# EAGLE design minidoxs (EAGLE 9.5.0)
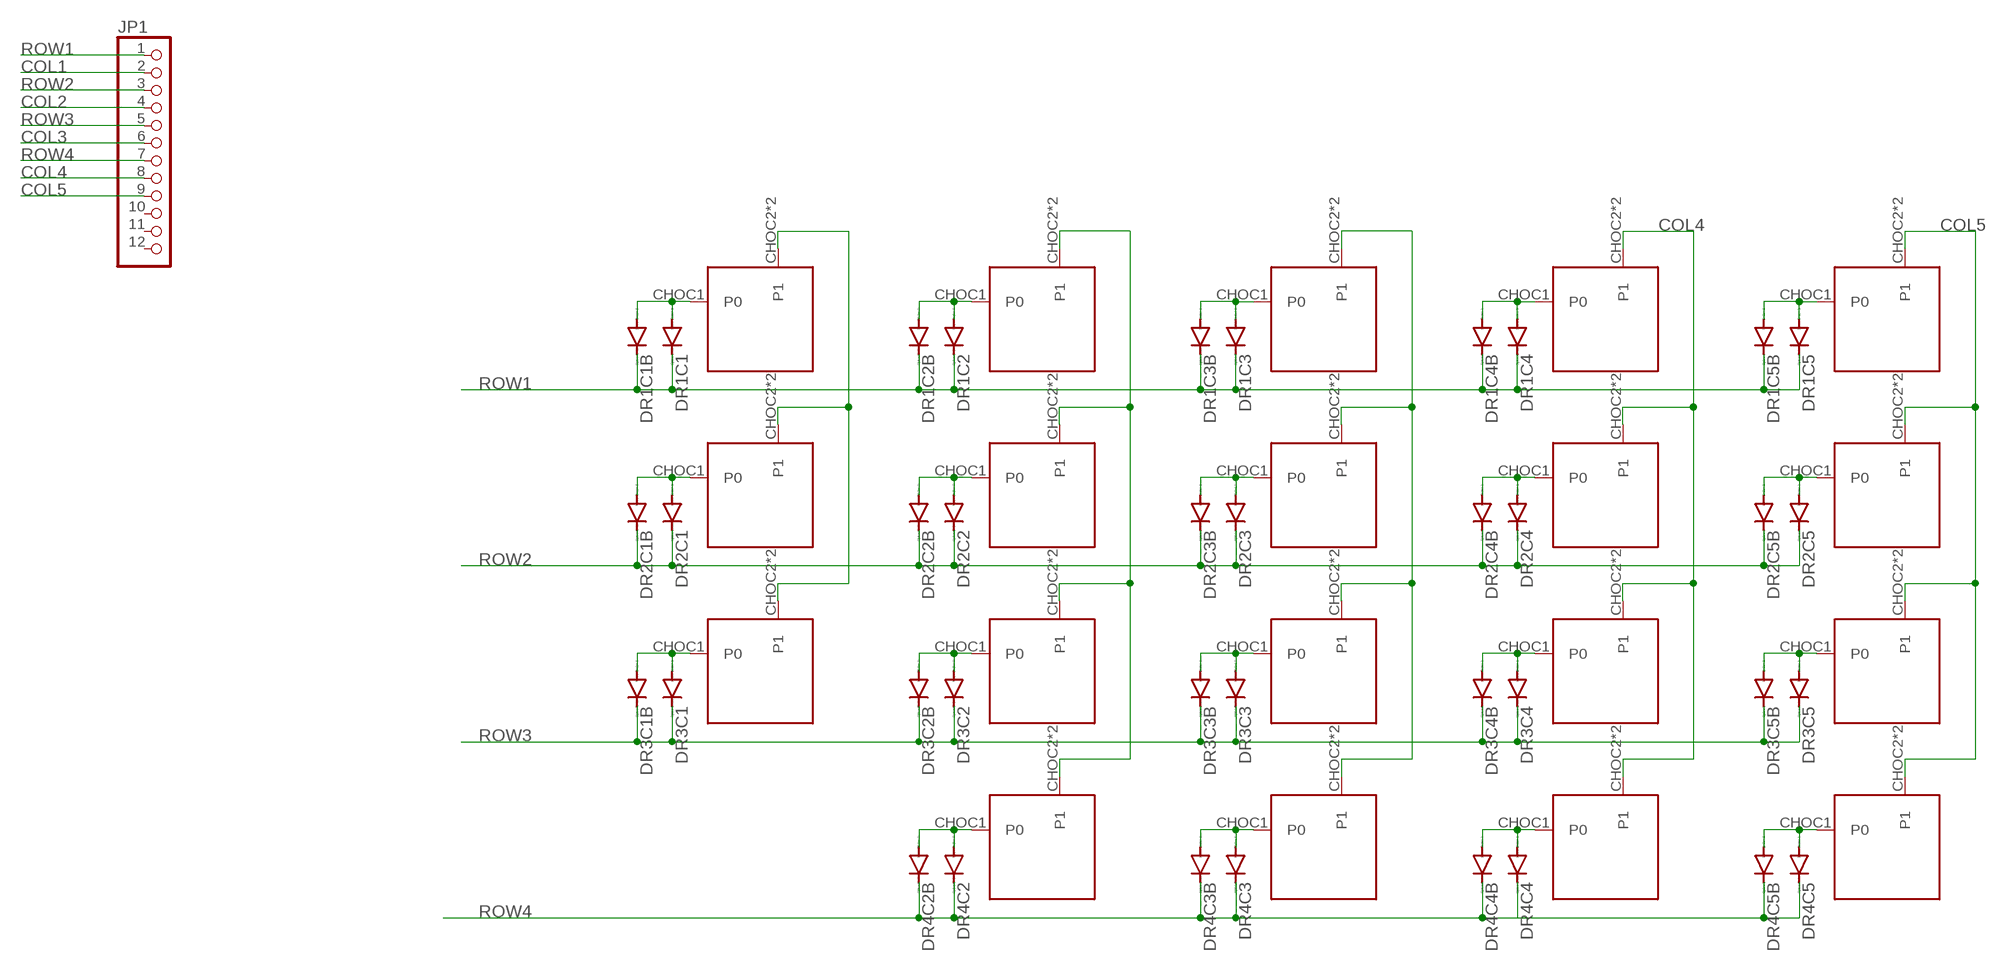
[diagram p0: schematic, sheet 1]

## Parts
DR1C1  MBR0520LT  [SOD123]
DR1C1B  MBR0520LT  [SOD123]
DR1C2  MBR0520LT  [SOD123]
DR1C2B  MBR0520LT  [SOD123]
DR1C3  MBR0520LT  [SOD123]
DR1C3B  MBR0520LT  [SOD123]
DR1C4  MBR0520LT  [SOD123]
DR1C4B  MBR0520LT  [SOD123]
DR1C5  MBR0520LT  [SOD123]
DR1C5B  MBR0520LT  [SOD123]
DR2C1  MBR0520LT  [SOD123]
DR2C1B  MBR0520LT  [SOD123]
DR2C2  MBR0520LT  [SOD123]
DR2C2B  MBR0520LT  [SOD123]
DR2C3  MBR0520LT  [SOD123]
DR2C3B  MBR0520LT  [SOD123]
DR2C4  MBR0520LT  [SOD123]
DR2C4B  MBR0520LT  [SOD123]
DR2C5  MBR0520LT  [SOD123]
DR2C5B  MBR0520LT  [SOD123]
DR3C1  MBR0520LT  [SOD123]
DR3C1B  MBR0520LT  [SOD123]
DR3C2  MBR0520LT  [SOD123]
DR3C2B  MBR0520LT  [SOD123]
DR3C3  MBR0520LT  [SOD123]
DR3C3B  MBR0520LT  [SOD123]
DR3C4  MBR0520LT  [SOD123]
DR3C4B  MBR0520LT  [SOD123]
DR3C5  MBR0520LT  [SOD123]
DR3C5B  MBR0520LT  [SOD123]
DR4C2  MBR0520LT  [SOD123]
DR4C2B  MBR0520LT  [SOD123]
DR4C3  MBR0520LT  [SOD123]
DR4C3B  MBR0520LT  [SOD123]
DR4C4  MBR0520LT  [SOD123]
DR4C4B  MBR0520LT  [SOD123]
DR4C5  MBR0520LT  [SOD123]
DR4C5B  MBR0520LT  [SOD123]
JP1  PINHD-1X12  [1X12]
U$R1C1  KEYSWITCH-PLAIN-CHOC-1U  [CHOC-1U]
U$R1C2  KEYSWITCH-PLAIN-CHOC-1U  [CHOC-1U]
U$R1C3  KEYSWITCH-PLAIN-CHOC-1U  [CHOC-1U]
U$R1C4  KEYSWITCH-PLAIN-CHOC-1U  [CHOC-1U]
U$R1C5  KEYSWITCH-PLAIN-CHOC-1U  [CHOC-1U]
U$R2C1  KEYSWITCH-PLAIN-CHOC-1U  [CHOC-1U]
U$R2C2  KEYSWITCH-PLAIN-CHOC-1U  [CHOC-1U]
U$R2C3  KEYSWITCH-PLAIN-CHOC-1U  [CHOC-1U]
U$R2C4  KEYSWITCH-PLAIN-CHOC-1U  [CHOC-1U]
U$R2C5  KEYSWITCH-PLAIN-CHOC-1U  [CHOC-1U]
U$R3C1  KEYSWITCH-PLAIN-CHOC-1U  [CHOC-1U]
U$R3C2  KEYSWITCH-PLAIN-CHOC-1U  [CHOC-1U]
U$R3C3  KEYSWITCH-PLAIN-CHOC-1U  [CHOC-1U]
U$R3C4  KEYSWITCH-PLAIN-CHOC-1U  [CHOC-1U]
U$R3C5  KEYSWITCH-PLAIN-CHOC-1U  [CHOC-1U]
U$R4C2  KEYSWITCH-PLAIN-CHOC-1U  [CHOC-1U]
U$R4C3  KEYSWITCH-PLAIN-CHOC-1U  [CHOC-1U]
U$R4C4  KEYSWITCH-PLAIN-CHOC-1U  [CHOC-1U]
U$R4C5  KEYSWITCH-PLAIN-CHOC-1U  [CHOC-1U]

## Nets
COL1: JP1.2 U$R1C1.CHOC2(P1) U$R1C1.CHOC3(P1) U$R2C1.CHOC2(P1) U$R2C1.CHOC3(P1) U$R3C1.CHOC2(P1) U$R3C1.CHOC3(P1)
COL2: JP1.4 U$R1C2.CHOC2(P1) U$R1C2.CHOC3(P1) U$R2C2.CHOC2(P1) U$R2C2.CHOC3(P1) U$R3C2.CHOC2(P1) U$R3C2.CHOC3(P1) U$R4C2.CHOC2(P1) U$R4C2.CHOC3(P1)
COL3: JP1.6 U$R1C3.CHOC2(P1) U$R1C3.CHOC3(P1) U$R2C3.CHOC2(P1) U$R2C3.CHOC3(P1) U$R3C3.CHOC2(P1) U$R3C3.CHOC3(P1) U$R4C3.CHOC2(P1) U$R4C3.CHOC3(P1)
COL4: JP1.8 U$R1C4.CHOC2(P1) U$R1C4.CHOC3(P1) U$R2C4.CHOC2(P1) U$R2C4.CHOC3(P1) U$R3C4.CHOC2(P1) U$R3C4.CHOC3(P1) U$R4C4.CHOC2(P1) U$R4C4.CHOC3(P1)
COL5: JP1.9 U$R1C5.CHOC2(P1) U$R1C5.CHOC3(P1) U$R2C5.CHOC2(P1) U$R2C5.CHOC3(P1) U$R3C5.CHOC2(P1) U$R3C5.CHOC3(P1) U$R4C5.CHOC2(P1) U$R4C5.CHOC3(P1)
N$1: DR1C1.A DR1C1B.A U$R1C1.CHOC1(P0)
N$2: DR2C1.A DR2C1B.A U$R2C1.CHOC1(P0)
N$3: DR1C5.A DR1C5B.A U$R1C5.CHOC1(P0)
N$4: DR1C4.A DR1C4B.A U$R1C4.CHOC1(P0)
N$5: DR1C3.A DR1C3B.A U$R1C3.CHOC1(P0)
N$6: DR2C2.A DR2C2B.A U$R2C2.CHOC1(P0)
N$7: DR2C3.A DR2C3B.A U$R2C3.CHOC1(P0)
N$8: DR2C4.A DR2C4B.A U$R2C4.CHOC1(P0)
N$9: DR1C2.A DR1C2B.A U$R1C2.CHOC1(P0)
N$10: DR2C5.A DR2C5B.A U$R2C5.CHOC1(P0)
N$11: DR3C4.A DR3C4B.A U$R3C4.CHOC1(P0)
N$12: DR3C3.A DR3C3B.A U$R3C3.CHOC1(P0)
N$13: DR3C2.A DR3C2B.A U$R3C2.CHOC1(P0)
N$14: DR3C1.A DR3C1B.A U$R3C1.CHOC1(P0)
N$15: DR3C5.A DR3C5B.A U$R3C5.CHOC1(P0)
N$16: DR4C4.A DR4C4B.A U$R4C4.CHOC1(P0)
N$17: DR4C3.A DR4C3B.A U$R4C3.CHOC1(P0)
N$18: DR4C2.A DR4C2B.A U$R4C2.CHOC1(P0)
N$19: DR4C5.A DR4C5B.A U$R4C5.CHOC1(P0)
ROW1: DR1C1.C DR1C1B.C DR1C2.C DR1C2B.C DR1C3.C DR1C3B.C DR1C4.C DR1C4B.C DR1C5.C DR1C5B.C JP1.1
ROW2: DR2C1.C DR2C1B.C DR2C2.C DR2C2B.C DR2C3.C DR2C3B.C DR2C4.C DR2C4B.C DR2C5.C DR2C5B.C JP1.3
ROW3: DR3C1.C DR3C1B.C DR3C2.C DR3C2B.C DR3C3.C DR3C3B.C DR3C4.C DR3C4B.C DR3C5.C DR3C5B.C JP1.5
ROW4: DR4C2.C DR4C2B.C DR4C3.C DR4C3B.C DR4C4.C DR4C4B.C DR4C5.C DR4C5B.C JP1.7
Unconnected: JP1.10 JP1.11 JP1.12

## Library data of the parts
DR1C1 DR1C1B DR1C2 DR1C2B DR1C3 DR1C3B DR1C4 DR1C4B DR1C5 DR1C5B DR2C1 DR2C1B DR2C2 DR2C2B DR2C3 DR2C3B DR2C4 DR2C4B DR2C5 DR2C5B DR3C1 DR3C1B DR3C2 DR3C2B DR3C3 DR3C3B DR3C4 DR3C4B DR3C5 DR3C5B DR4C2 DR4C2B DR4C3 DR4C3B DR4C4 DR4C4B DR4C5 DR4C5B = diode:MBR0520LT: SCHOTTKY BARRIER RECTIFIER Source: http://onsemi.com .. MBR0520LT1-D.pdf
JP1 = pinhead:PINHD-1X12: PIN HEADER
U$R1C1-U$R1C5 U$R2C1-U$R2C5 U$R3C1-U$R3C5 U$R4C2-U$R4C5 = Keyboard:KEYSWITCH-PLAIN

## Net classes
0 default: width 0.406 mm, clearance 0.406 mm

## Board
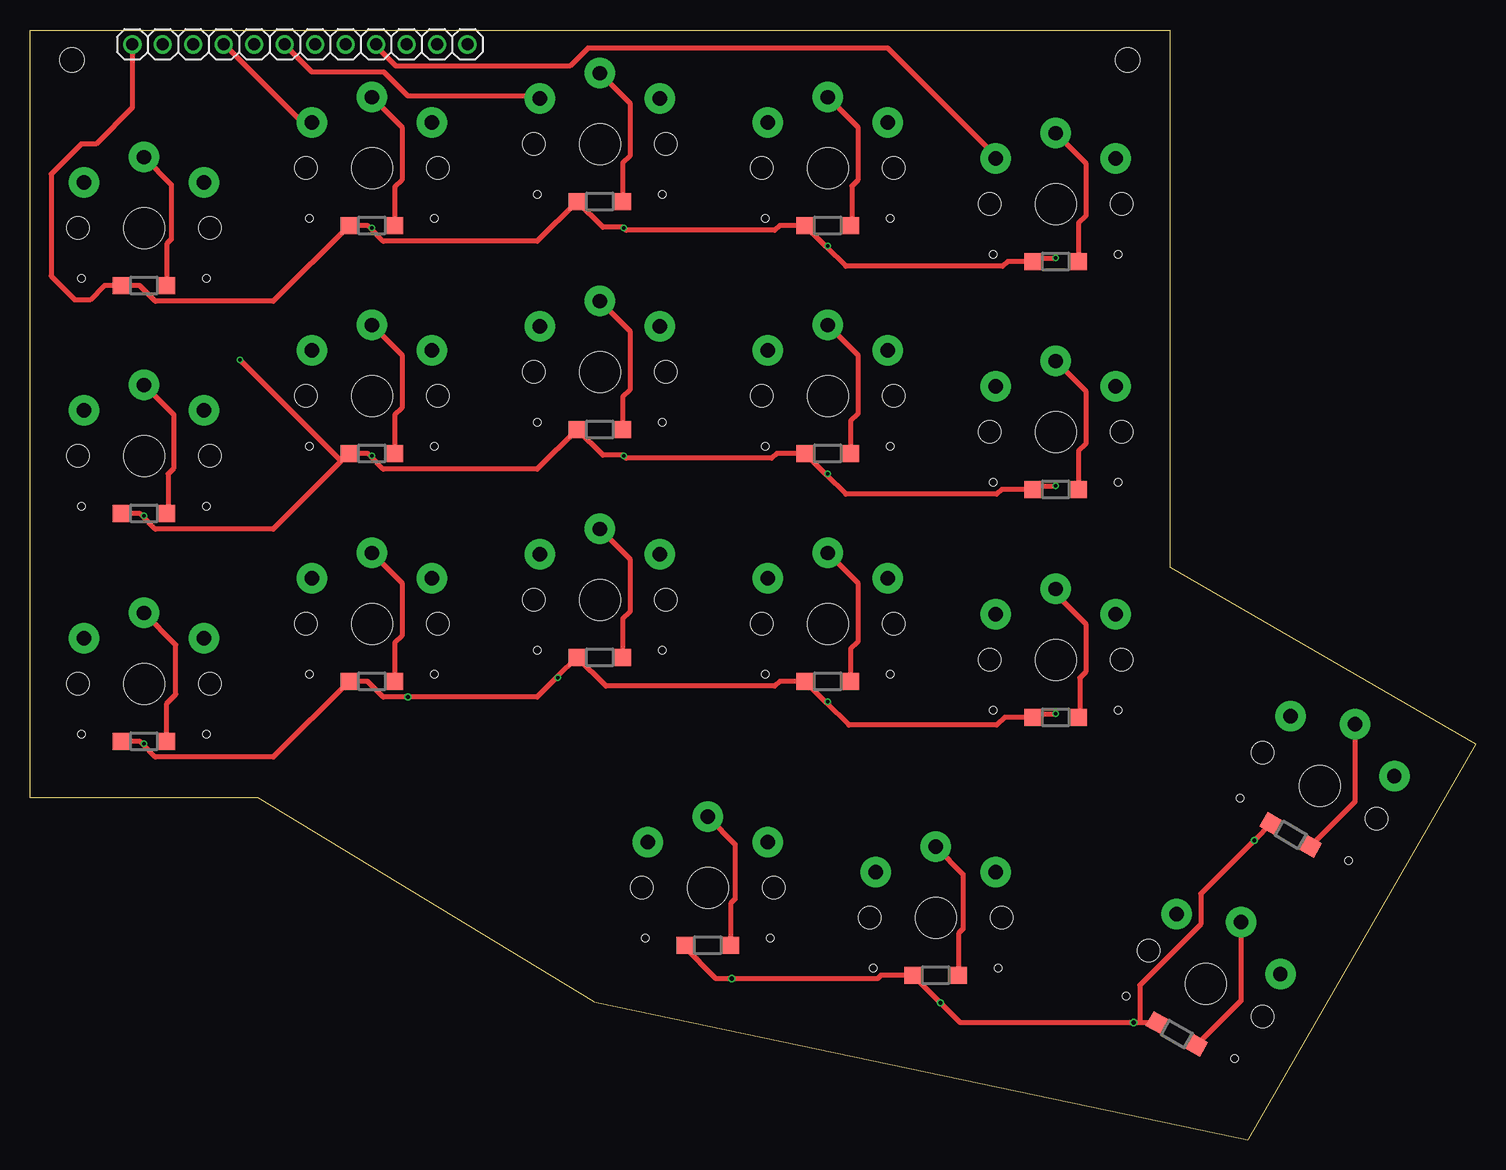
[diagram p1: board, top side]
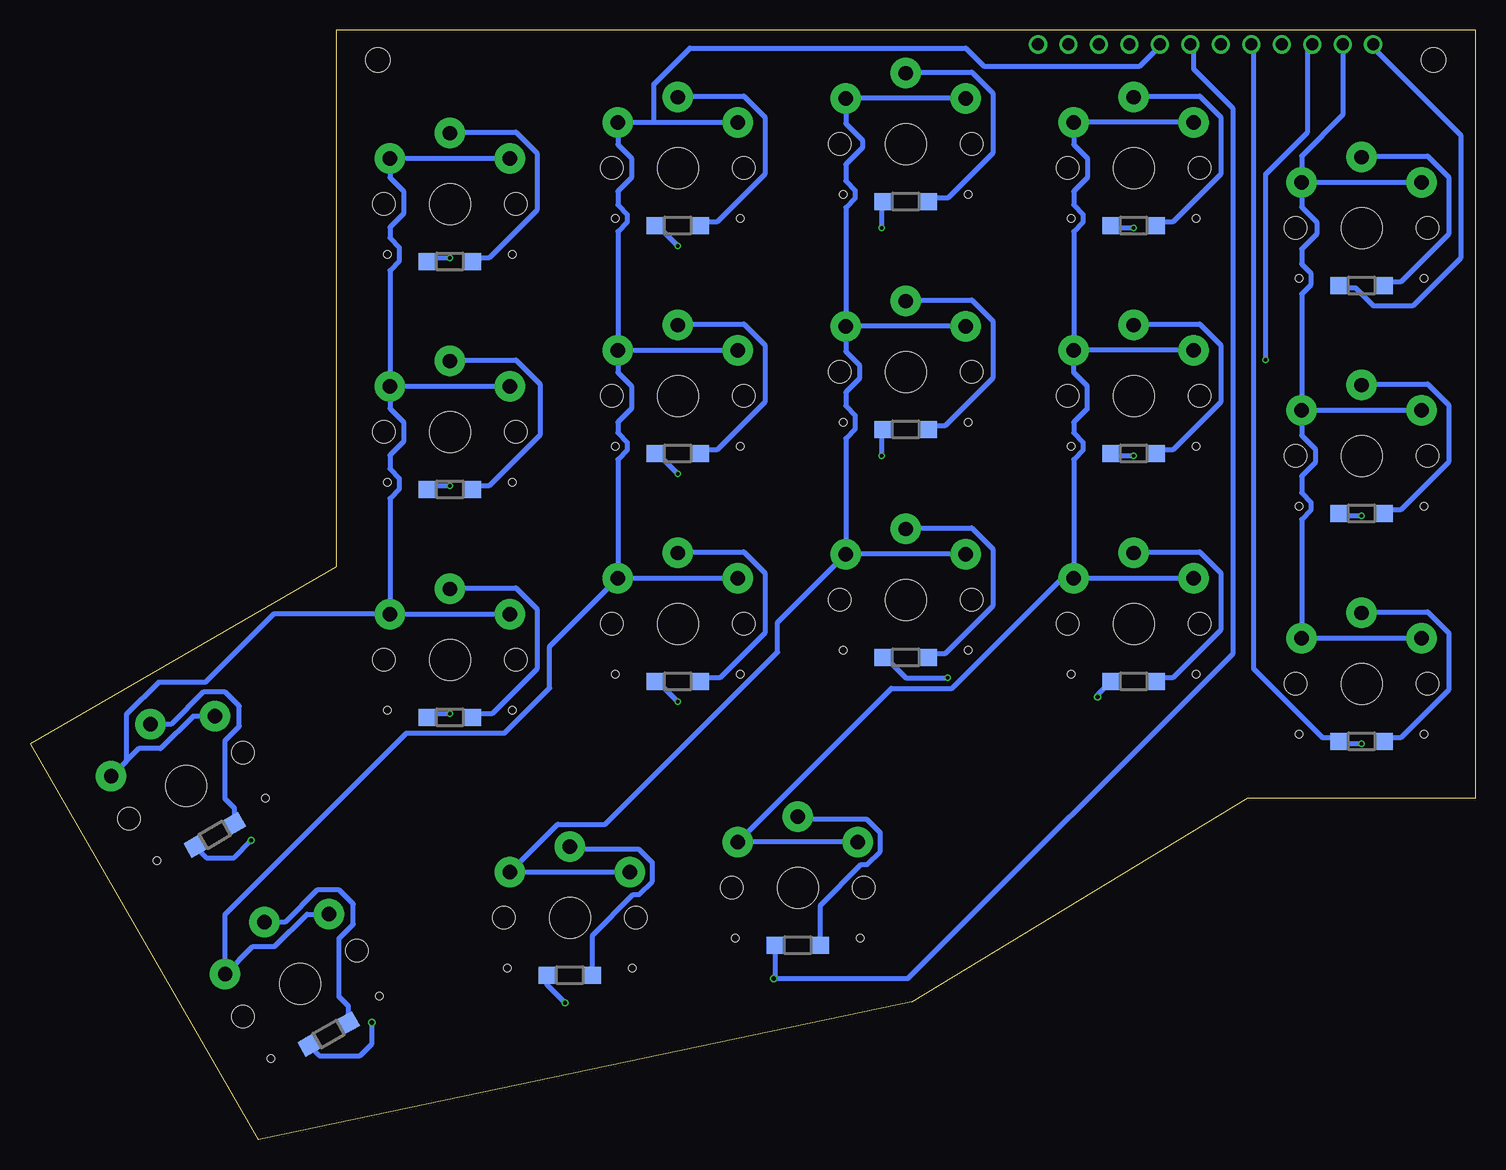
[diagram p2: board, bottom side, seen from below]

Size 120.5 x 92.5 mm. Coordinates in mm from the lower left corner, seen from the top.
Outline: 0,92.5 95,92.5 95,47.75 120.5,33 101.5,0 47,11.5 19,28.5 0,28.5 0,92.5
Copper layers (1*16): Top 0.035559375mm / dielectric 1.6mm / Bottom 0.035559375mm
Design rules "oshpark-2layer": minimum track width 6mil, minimum drill 10mil, track to track 6mil, track to pad 6mil, pad to pad 6mil, via to via 6mil, smd to smd 6mil, copper to edge 15mil, drill to drill 6mil, minimum pad ring 5mil, minimum via ring 5mil, stop-mask expansion 2.5mil, vias tented up to drill 0mil, thermal gap 10mil
Holes 2 mm at 3.5,90 91.5,90

### Footprints (pad centres in the part's own frame; a part is rotated, then mirrored left to right if it is on the bottom)
SOD123 = smd 1.4 x 1.4: A 1.9,0; C -1.9,0
1X12 = drill 1.016: 1 -13.97,0; 2 -11.43,0; 3 -8.89,0; 4 -6.35,0; 5 -3.81,0; 6 -1.27,0; 7 1.27,0; 8 3.81,0; 9 6.35,0; 10 8.89,0; 11 11.43,0; 12 13.97,0
CHOC-1U = drill 1.2 pad 2.54: CHOC1 0,5.9; CHOC2 5,3.8; CHOC3 -5,3.8 | hole 3.4: 0,0 | hole 0.6: -5.22,-4.2; 5.22,-4.2 | hole 1.85: -5.5,0; 5.5,0

### Placement (x,y rotation side)
DR1C1  9.5,71.2 0 top
DR1C1B  9.5,71.2 0 bottom
DR1C2  28.5,76.2 0 top
DR1C2B  28.5,76.2 0 bottom
DR1C3  47.5,78.2 0 top
DR1C3B  47.5,78.2 0 bottom
DR1C4  66.5,76.2 0 top
DR1C4B  66.5,76.2 0 bottom
DR1C5  85.5,73.2 0 top
DR1C5B  85.5,73.2 0 bottom
DR2C1  9.5,52.2 0 top
DR2C1B  9.5,52.2 0 bottom
DR2C2  28.5,57.2 0 top
DR2C2B  28.5,57.2 0 bottom
DR2C3  47.5,59.2 0 top
DR2C3B  47.5,59.2 0 bottom
DR2C4  66.5,57.2 0 top
DR2C4B  66.5,57.2 0 bottom
DR2C5  85.5,54.2 0 top
DR2C5B  85.5,54.2 0 bottom
DR3C1  9.5,33.2 0 top
DR3C1B  9.5,33.2 0 bottom
DR3C2  28.5,38.2 0 top
DR3C2B  28.5,38.2 0 bottom
DR3C3  47.5,40.2 0 top
DR3C3B  47.5,40.2 0 bottom
DR3C4  66.5,38.2 0 top
DR3C4B  66.5,38.2 0 bottom
DR3C5  85.5,35.2 0 top
DR3C5B  85.5,35.2 0 bottom
DR4C2  56.5,16.2 0 top
DR4C2B  56.5,16.2 0 bottom
DR4C3  75.5,13.7 0 top
DR4C3B  75.5,13.7 0 bottom
DR4C4  95.6,8.8 330 top
DR4C4B  95.6,8.8 30 bottom
DR4C5  105.1,25.4 330 top
DR4C5B  105.1,25.4 30 bottom
JP1  22.5,91.3 0 top
U$R1C1  9.5,76 0 top
U$R1C2  28.5,81 0 top
U$R1C3  47.5,83 0 top
U$R1C4  66.5,81 0 top
U$R1C5  85.5,78 0 top
U$R2C1  9.5,57 0 top
U$R2C2  28.5,62 0 top
U$R2C3  47.5,64 0 top
U$R2C4  66.5,62 0 top
U$R2C5  85.5,59 0 top
U$R3C1  9.5,38 0 top
U$R3C2  28.5,43 0 top
U$R3C3  47.5,45 0 top
U$R3C4  66.5,43 0 top
U$R3C5  85.5,40 0 top
U$R4C2  56.5,21 0 top
U$R4C3  75.5,18.5 0 top
U$R4C4  98,13 330 top
U$R4C5  107.5,29.5 330 top

### Tracks (layer width: path | path; a pad name or v marks a point on that pad's centre or on a via)
COL1
  Bottom 0.406: U$R1C1.CHOC2 14.5,82 11.07,85.43 JP1.2 | U$R1C1.CHOC2 U$R1C1.CHOC3 | U$R1C1.CHOC2 14.5,77.75 13.25,76.5 13.25,75.5 14.5,74.25 14.5,73 13.75,72.25 13.75,71.25 14.5,70.5 U$R2C1.CHOC2 | U$R2C1.CHOC2 14.5,58.7 13.37,57.57 13.37,56.43 14.5,55.3 14.5,53.9 13.71,53.11 13.71,52.49 14.5,51.7 U$R3C1.CHOC2 U$R3C1.CHOC3 | U$R2C1.CHOC2 U$R2C1.CHOC3
COL2
  Top 0.406: JP1.4 16.5,91 22.5,85 23.5,85 U$R1C2.CHOC3
  Bottom 0.406: U$R1C2.CHOC2 33.5,84.5 | 33.5,84.5 33.5,82.95 32.37,81.82 32.37,80.18 33.5,79.05 33.5,77.9 32.71,77.11 32.71,76.49 33.5,75.7 U$R2C2.CHOC2 33.5,65.5 | 33.5,65.5 33.5,63.95 32.37,62.82 32.37,60.93 33.5,59.8 33.5,58.9 32.71,58.11 32.71,57.49 33.5,56.7 U$R3C2.CHOC2 | U$R2C2.CHOC3 33.2,65.8 33.5,65.5 | U$R3C2.CHOC2 U$R3C2.CHOC3 | U$R1C2.CHOC3 33.2,84.8 33.5,84.5 | U$R4C2.CHOC3 U$R4C2.CHOC2 48.69,37.61 43.63,37.61 34.44,46.8 U$R3C2.CHOC2
COL3
  Top 0.406: JP1.6 21.5,91 23.5,89 29.5,89 31.5,87 42.5,87 U$R1C3.CHOC3
  Bottom 0.406: 52.5,67.5 U$R2C3.CHOC2 52.5,77.7 51.71,78.49 51.71,79.11 52.5,79.9 52.5,81.3 51.12,82.68 51.12,83.32 52.5,84.7 U$R1C3.CHOC2 U$R1C3.CHOC3 | 52.5,67.5 52.5,65.7 51.37,64.57 51.37,63.43 52.5,62.3 52.5,61.15 51.71,60.36 51.71,59.24 52.5,58.45 U$R3C3.CHOC2 | U$R2C3.CHOC3 52.2,67.8 52.5,67.5 | U$R3C3.CHOC3 52.3,48.8 52.5,49 U$R3C3.CHOC2 | U$R3C3.CHOC2 58.19,43.11 58.19,40.64 72.55,26.28 76.52,26.28 U$R4C3.CHOC2 U$R4C3.CHOC3
COL4
  Bottom 0.406: U$R2C4.CHOC2 71.5,63.95 70.37,62.82 70.37,60.93 71.5,59.8 71.5,58.9 70.71,58.11 70.71,57.49 71.5,56.7 U$R3C4.CHOC2 | U$R3C4.CHOC2 62.3,46.8 62,46.5 61.8,46.5 U$R3C4.CHOC3 | U$R2C4.CHOC2 U$R2C4.CHOC3 | 68.5,84.8 U$R1C4.CHOC2 71.5,82.95 70.37,81.82 70.37,80.18 71.5,79.05 71.5,77.9 70.71,77.11 70.71,76.49 71.5,75.7 U$R2C4.CHOC2 | 68.5,84.8 U$R1C4.CHOC3 | 68.5,84.8 68.5,88 65.5,91 42.5,91 41,89.5 28,89.5 26.5,91 JP1.8 | U$R3C4.CHOC2 77.19,41.11 77.19,37.64 80.94,33.89 89.11,33.89 104.23,18.77 U$R4C4.CHOC2 101.93,16.09 100.11,16.09 97.42,18.79 U$R4C4.CHOC3
COL5
  Top 0.406: JP1.9 29,91 30.5,89.5 45,89.5 46.5,91 71.5,91 80.5,82 U$R1C5.CHOC3
  Bottom 0.406: U$R2C5.CHOC2 90.5,60.95 89.37,59.82 89.37,58.18 90.5,57.05 90.5,55.9 89.71,55.11 89.71,54.24 90.5,53.45 U$R3C5.CHOC2 | U$R1C5.CHOC3 U$R1C5.CHOC2 90.5,80.2 89.37,79.07 89.37,77.18 90.5,76.05 90.5,75.15 89.71,74.36 89.71,73.24 90.5,72.45 U$R2C5.CHOC2 | U$R2C5.CHOC2 U$R2C5.CHOC3 | U$R3C5.CHOC2 U$R3C5.CHOC3 | U$R4C5.CHOC3 106.92,35.29 109.61,32.59 111.43,32.59 U$R4C5.CHOC2 114,30.02 114,30 112.47,31.53 112.47,35.45 109.79,38.12 105.88,38.12 100.2,43.8 U$R3C5.CHOC2
N$1
  Top 0.406: DR1C1.A 11.4,74.67 11.78,75.05 11.78,79.62 U$R1C1.CHOC1
  Bottom 0.406: DR1C1B.A 7.5,71.5 6.25,71.5 2.25,75.5 2.25,80.25 4,82 9.5,82 U$R1C1.CHOC1
N$2
  Top 0.406: DR2C1.A 11.5,52.3 11.5,55.5 12,56 12,60.4 U$R2C1.CHOC1
  Bottom 0.406: DR2C1B.A 7.5,52.5 6.25,52.5 2.25,56.5 2.25,61.25 4,63 9.5,63 U$R2C1.CHOC1
N$3
  Top 0.406: DR1C5.A 87.4,76.4 88,77 88,81.4 U$R1C5.CHOC1
  Bottom 0.406: DR1C5B.A 83.5,73.5 82.25,73.5 78.25,77.5 78.25,82.25 80,84 85.5,84 U$R1C5.CHOC1
N$4
  Top 0.406: DR1C4.A 68.5,76.3 68.5,79.5 69,80 69,84.4 U$R1C4.CHOC1
  Bottom 0.406: DR1C4B.A 64.5,76.5 63.25,76.5 59.25,80.5 59.25,85.25 61,87 66.5,87 U$R1C4.CHOC1
N$5
  Top 0.406: DR1C3.A 49.4,81.4 50,82 50,86.4 U$R1C3.CHOC1
  Bottom 0.406: DR1C3B.A 45.5,78.5 44,78.5 40.25,82.25 40.25,87.25 42,89 47.5,89 U$R1C3.CHOC1
N$6
  Top 0.406: DR2C2.A 30.4,60.4 31,61 31,65.4 U$R2C2.CHOC1
  Bottom 0.406: DR2C2B.A 26.5,57.5 25.25,57.5 21.25,61.5 21.25,66.25 23,68 28.5,68 U$R2C2.CHOC1
N$7
  Top 0.406: DR2C3.A 49.4,61.9 50,62.5 50,67.4 U$R2C3.CHOC1
  Bottom 0.406: DR2C3B.A 45.5,59.5 44.25,59.5 40.25,63.5 40.25,68.25 42,70 47.5,70 U$R2C3.CHOC1
N$8
  Top 0.406: DR2C4.A 68.4,59.9 69,60.5 69,65.4 U$R2C4.CHOC1
  Bottom 0.406: DR2C4B.A 64.5,57.5 63.25,57.5 59.25,61.5 59.25,66.25 61,68 66.5,68 U$R2C4.CHOC1
N$9
  Top 0.406: DR1C2.A 30.4,79.4 31,80 31,84.4 U$R1C2.CHOC1
  Bottom 0.406: DR1C2B.A 26.5,76.5 25.25,76.5 21.25,80.5 21.25,85.25 23,87 28.5,87 U$R1C2.CHOC1
N$10
  Top 0.406: DR2C5.A 87.4,57.4 88,58 88,62.4 U$R2C5.CHOC1
  Bottom 0.406: DR2C5B.A 83.5,54.5 82.25,54.5 78,58.75 78,63 80,65 85.5,65 U$R2C5.CHOC1
N$11
  Top 0.406: DR3C4.A 68.4,40.9 69,41.5 69,46.4 U$R3C4.CHOC1
  Bottom 0.406: DR3C4B.A 64.5,38.5 63,38.5 59.25,42.25 59.25,47.25 61,49 66.5,49 U$R3C4.CHOC1
N$12
  Top 0.406: DR3C3.A 49.4,43.4 50,44 50,48.4 U$R3C3.CHOC1
  Bottom 0.406: DR3C3B.A 45.5,40.5 44.25,40.5 40.25,44.5 40.25,49.25 42,51 47.5,51 U$R3C3.CHOC1
N$13
  Top 0.406: DR3C2.A 30.4,41.4 31,42 31,46.4 U$R3C2.CHOC1
  Bottom 0.406: DR3C2B.A 26.5,38.5 25.25,38.5 21.25,42.5 21.25,47.25 23,49 28.5,49 U$R3C2.CHOC1
N$14
  Top 0.406: DR3C1.A 11.4,36.35 12.16,37.11 12.16,41.24 U$R3C1.CHOC1
  Bottom 0.406: DR3C1B.A 7.5,33.5 6.25,33.5 2.25,37.5 2.25,42.25 4,44 9.5,44 U$R3C1.CHOC1
N$15
  Top 0.406: DR3C5.A 87.5,35.5 87.5,38.5 88,39 88,43 85.5,45.5 U$R3C5.CHOC1
  Bottom 0.406: DR3C5B.A 83.5,35.5 82,35.5 78.25,39.25 78.25,44.25 80,46 85.5,46 U$R3C5.CHOC1
N$16
  Top 0.406: U$R4C4.CHOC1 100.95,11.55 DR4C4.A
  Bottom 0.406: DR4C4B.A 93.95,11.11 94.75,11.91 94.75,16.76 93.55,17.95 93.55,19.63 94.73,20.81 96.55,20.81 99.25,18.11 U$R4C4.CHOC1
N$17
  Top 0.406: DR4C3.A 77.4,17.17 77.78,17.55 77.78,22.12 U$R4C3.CHOC1
  Bottom 0.406: U$R4C3.CHOC1 75.28,24.18 69.72,24.18 68.62,23.08 68.62,21.52 69.72,20.42 70.21,20.42 73.6,17.03 DR4C3B.A
N$18
  Top 0.406: DR4C2.A 58.4,19.67 58.78,20.05 58.78,24.62 U$R4C2.CHOC1
  Bottom 0.406: U$R4C2.CHOC1 56.28,26.68 50.72,26.68 49.62,25.58 49.62,24.02 50.72,22.92 51.21,22.92 54.6,19.53 DR4C2B.A
N$19
  Top 0.406: U$R4C5.CHOC1 110.45,28.16 DR4C5.A
  Bottom 0.406: DR4C5B.A 103.45,27.61 104.25,28.41 104.25,33.26 103.05,34.45 103.05,36.13 104.23,37.31 106.05,37.31 108.75,34.61 U$R4C5.CHOC1
ROW1  (via drill 0.3)
  Top 0.406: JP1.1 8.53,86.03 5.5,83 4.25,83 1.75,80.5 1.75,72 3.75,70 5,70 6.2,71.2 DR1C1.C 9.14,71.2 10.45,69.89 20.29,69.89 DR1C2.C 28.14,76.2 28.42,75.92 | 28.42,75.92 29.45,74.89 42.29,74.89 DR1C3.C 47.76,76.04 49.5,76.04 v49.5,76 49.71,75.79 62.09,75.79 62.5,76.2 DR1C4.C 66.4,74.4 | 66.4,74.4 68.01,72.79 81.09,72.79 81.5,73.2 DR1C5.C 84,73.5 v85.5,73.5 | v28.5,76 28.42,75.92 | v66.5,74.5 66.4,74.4
  Bottom 0.406: DR1C1B.C 11,71 10,71 8.5,69.5 5.25,69.5 1.25,73.5 1.25,83.75 8.5,91 JP1.1 | v28.5,76 30,76 DR1C2B.C | v49.5,76 49.5,78 DR1C3B.C | v66.5,74.5 68,76 DR1C4B.C | v85.5,73.5 87,73.5 DR1C5B.C
ROW2  (via drill 0.3)
  Top 0.406: DR2C1.C 9.14,52.2 9.42,51.92 | 9.42,51.92 10.45,50.89 20.29,50.89 25.95,56.55 | 25.95,56.55 DR2C2.C 28.14,57.2 28.42,56.92 | 28.42,56.92 29.45,55.89 42.29,55.89 DR2C3.C 47.76,57.04 49.5,57.04 v49.5,57 49.71,56.79 61.84,56.79 62.25,57.2 DR2C4.C 66.4,55.4 | 66.4,55.4 68.01,53.79 80.59,53.79 81,54.2 DR2C5.C 84,54.5 v85.5,54.5 | v9.5,52 9.42,51.92 | v28.5,57 28.42,56.92 | v66.5,55.5 66.4,55.4 | 25.95,56.55 v17.5,65
  Bottom 0.406: v9.5,52 11,52 DR2C1B.C | v28.5,57 30,57 DR2C2B.C | v49.5,57 49.5,59 DR2C3B.C | v66.5,55.5 68,57 DR2C4B.C | v85.5,54.5 87,54.5 DR2C5B.C | v17.5,65 17.5,80.5 14,84 14,91 JP1.3
ROW3  (via drill 0.3, 0.35)
  Top 0.406: DR3C1.C 9.14,33.2 9.42,32.92 | 9.42,32.92 10.45,31.89 20.29,31.89 DR3C2.C 28.14,38.2 29.45,36.89 v31.5,36.89 42.29,36.89 43.95,38.55 | 43.95,38.55 DR3C3.C 48.01,37.79 62.09,37.79 62.5,38.2 DR3C4.C 66.4,36.4 | 66.4,36.4 68.26,34.54 80.59,34.54 81.25,35.2 DR3C5.C 84,35.5 v85.5,35.5 | v9.5,33 9.42,32.92 | v66.5,36.5 66.4,36.4 | v44,38.5 43.95,38.55
  Bottom 0.406: v44,38.5 47.5,38.5 49,40 DR3C3B.C | v9.5,33 11,33 DR3C1B.C 11.5,33.5 12.75,33.5 18.5,39.25 18.5,91 JP1.5 | v66.5,36.5 68,38 DR3C4B.C | v85.5,35.5 87,35.5 DR3C5B.C | DR3C2B.C 31.5,37.1 v31.5,36.89
ROW4  (via drill 0.35)
  Top 0.406: DR4C2.C 54.5,16.1 57.18,13.42 v58.5,13.42 70.65,13.42 70.93,13.7 DR4C3.C v75.9,11.4 77.55,9.75 v92,9.75 92.5,9.75 | DR4C4.C 92.5,9.75 | DR4C5.C v102.05,24.95 97.59,20.48 97.59,17.95 92.5,12.87 92.5,9.75
  Bottom 0.406: JP1.7 23.5,91 23.5,89.25 20.25,86 20.25,40.5 47.33,13.42 v58.5,13.42 58.5,13.5 58.4,13.6 DR4C2B.C | DR4C3B.C 77.4,12.9 v75.9,11.4 | DR4C4B.C 96.39,7 93,7 92,8 v92,9.75 | DR4C5B.C 105.8,23.5 103.5,23.5 v102.05,24.95